# EAGLE design SparkFun_Transceiver_Breakout_RPSMA (EAGLE 7.4.0)
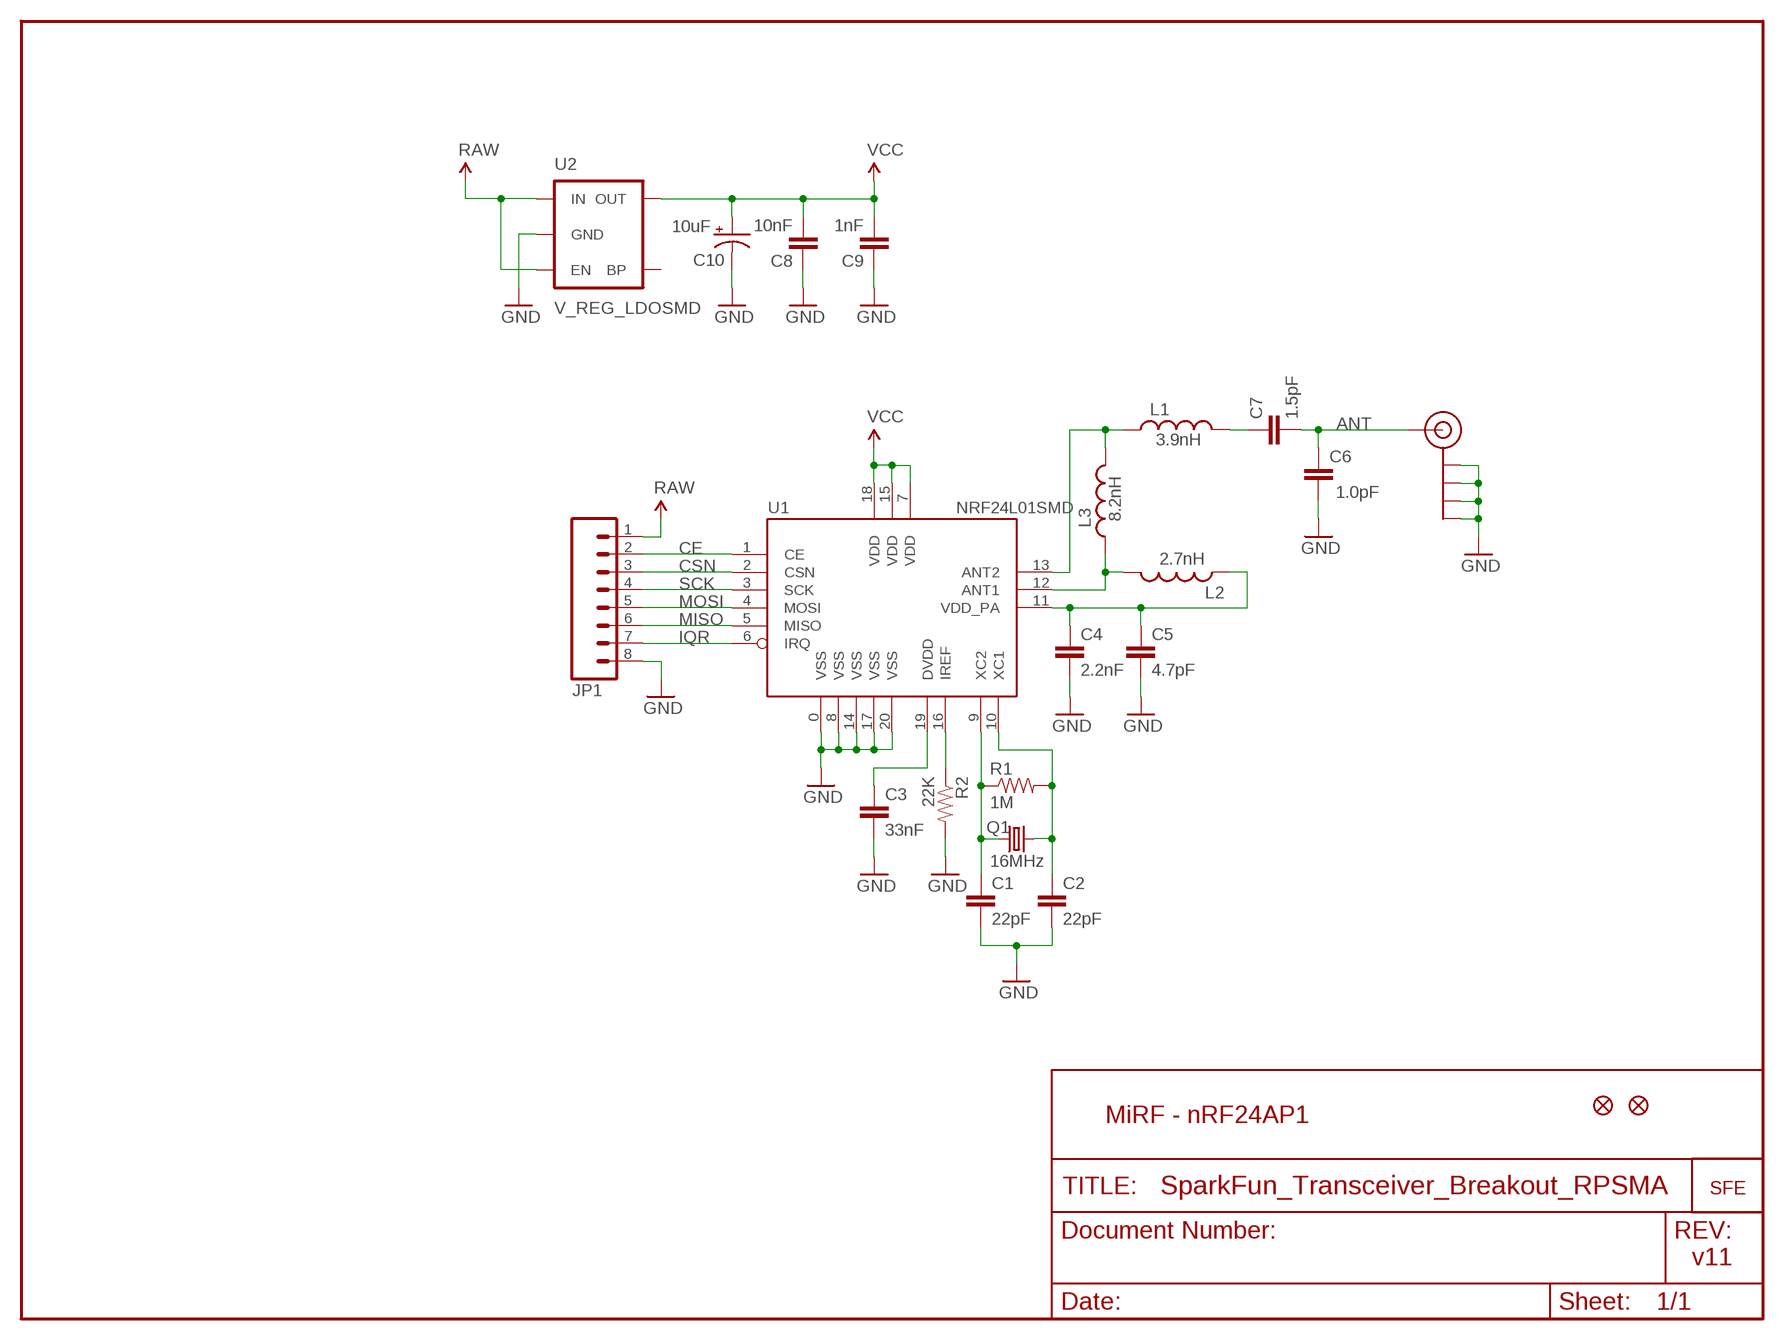
[diagram p0: schematic, sheet 1]

## Parts
C1  22pF  CAP0402  [C0402]
C2  22pF  CAP0402  [C0402]
C3  33nF  CAP0402  [C0402]
C4  2.2nF  CAP0402  [C0402]
C5  4.7pF  CAP0402  [C0402]
C6  1.0pF  CAP0402  [C0402]
C7  1.5pF  CAP0402  [C0402]
C8  10nF  CAP0402  [C0402]
C9  1nF  CAP0402  [C0402]
C10  10uF  CAP_POL1206  [EIA3216]
FID1  FIDUCIALUFIDUCIAL  [MICRO-FIDUCIAL]
FID2  FIDUCIALUFIDUCIAL  [MICRO-FIDUCIAL]
J$1  SMA_EDGE  [SMA-EDGE]
JP1  M08  [1X08]
L1  3.9nH  INDUCTOR0402  [C0402]
L2  2.7nH  INDUCTOR0402  [C0402]
L3  8.2nH  INDUCTOR0402  [C0402]
Q1  16MHz  CRYSTAL5X3  [CRYSTAL-SMD-5X3]
R1  1M  RESISTOR0402  [C0402]
R2  22K  RESISTOR0402  [C0402]
U1  NRF24L01SMD  [QFN20]
U2  V_REG_LDOSMD  [SOT23-5]
U$5  LOGO-SFENEW  [SFE-NEW-WEBLOGO]

## Nets
ANT: C6.2 C7.2 J$1.SIG(SIGNAL)
CE: JP1.2 U1.1(CE)
CSN: JP1.3 U1.2(CSN)
GND: C1.2 C2.2 C3.2 C4.2 C5.2 C6.1 C8.1 C9.1 C10.C(-) J$1.GND@0(GND) J$1.GND@1(GND) J$1.GND@2(GND) J$1.GND@3(GND) JP1.8 R2.2 U1.0(VSS) U1.8(VSS) U1.14(VSS) U1.17(VSS) U1.20(VSS) U2.2(GND)
IQR: JP1.7 U1.6(IRQ)
MISO: JP1.6 U1.5(MISO)
MOSI: JP1.5 U1.4(MOSI)
N$1: C1.1 Q1.1 R1.1 U1.9(XC2)
N$2: C2.1 Q1.3 R1.2 U1.10(XC1)
N$3: L2.2 L3.1 U1.12(ANT1)
N$4: R2.1 U1.16(IREF)
N$5: C3.1 U1.19(DVDD)
N$6: L1.1 L3.2 U1.13(ANT2)
N$7: C4.1 C5.1 L2.1 U1.11(VDD_PA)
N$9: C7.1 L1.2
RAW: JP1.1 U2.1(IN) U2.3(EN)
SCK: JP1.4 U1.3(SCK)
VCC: C8.2 C9.2 C10.A(+) U1.7(VDD) U1.15(VDD) U1.18(VDD) U2.5(OUT)
Unconnected: U2.4(BP)

## Notes on the sheet
- MiRF - nRF24AP1
- v11

## Library data of the parts
C1-C9 = SparkFun:CAP: Capacitor Standard 0603 ceramic capacitor, and 0.1" leaded capacitor.
C10 = SparkFun:CAP_POL: Capacitor Polarized These are standard SMD and PTH capacitors. Normally 10uF, 47uF, and 100uF in electrolytic and tantalum varieties. Always verify the external diameter of the through hole cap, it varies with capacity, voltage, and manufacturer. The EIA devices should be standard.
FID1 FID2 = SparkFun-Aesthetics:FIDUCIAL: Fiducial Alignment Points Various fiducial points for machine vision alignment.
J$1 = SparkFun:SMA_EDGE: SMA Antenna Connector End launch SMA connector. The paste layer has been removed so that the connector can be hand soldered onto the board after reflow.
JP1 = SparkFun:M08: Header 8 Standard 8-pin 0.1" header. Use with straight break away headers (SKU : PRT-00116), right angle break away headers (PRT-00553), swiss pins (PRT-00743), machine pins (PRT-00117), and female headers (PRT-00115).
L1-L3 = SparkFun:INDUCTOR: Inductors Basic Inductor/Choke - 0603 and 1206. Footprints are not proven and vary greatly between part numbers.
Q1 = SparkFun:CRYSTAL: Crystals Various standard crystals. Proven footprints. Spark Fun Electronics SKU : COM-00534
R1 R2 = SparkFun:RESISTOR: Resistor Basic schematic elements and footprints for 0603, 1206, and PTH 1/10th watt (small) resistors.
U1 = SparkFun:NRF24L01: 2.4GHz Low Power Transceiver This is the very popular, low cost, very low power RF transceiver from Nordic Semiconductor. Simple SPI interface. SKU: COM-00690
U2 = SparkFun:V_REG_LDO: Voltage Regulator LDO Standard 150mA LDO voltage regulator in SOT-23 layout. Micrel part MIC5205. BP (by-pass) pin is used to lower output noise with 470pF cap.
U$5 = SparkFun:LOGO-SFE: Spark Fun Electronics PCB Logo This is the standard Spark Fun Electronics PCB logo.

## Board
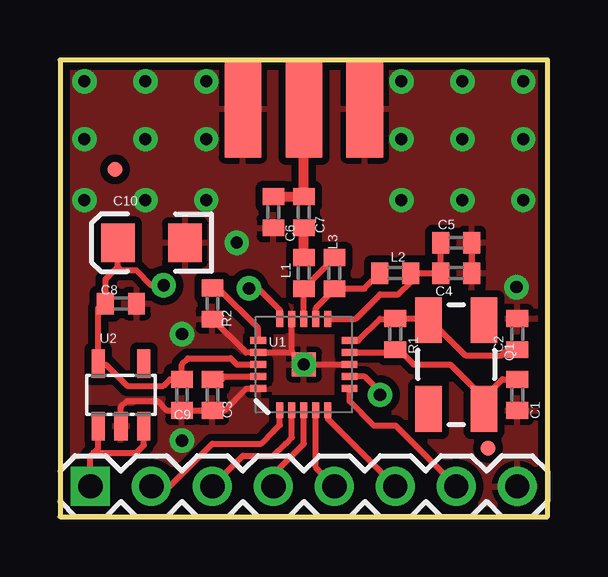
[diagram p1: board, top side]
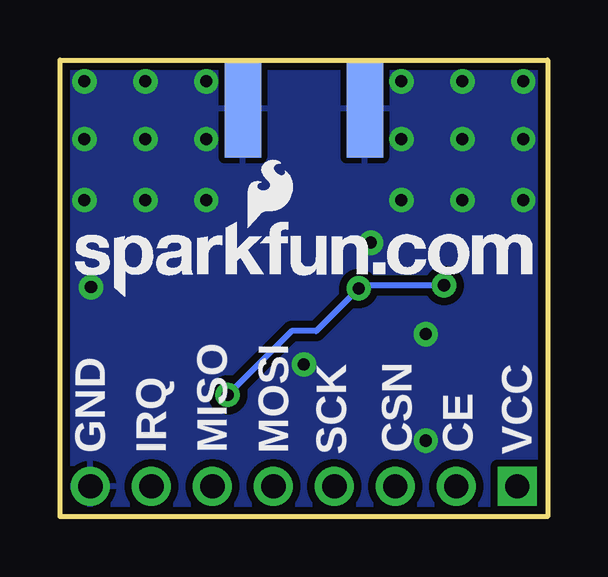
[diagram p2: board, bottom side, seen from below]

Size 20.32 x 19.05 mm. Coordinates in mm from the lower left corner, seen from the top.
Outline: 0,0 20.32,0 20.32,19.05 0,19.05 0,0
Copper layers (1*16): Top 0.035mm / dielectric 1.5mm / Bottom 0.035mm
Design rules "SparkFun *": minimum track width 8mil, minimum drill 20mil, track to track 8mil, track to pad 8mil, pad to pad 7mil, via to via 8mil, smd to smd 8mil, copper to edge 10mil, drill to drill 8mil, minimum pad ring 12mil, minimum via ring 10mil, stop-mask expansion 4mil, vias tented up to drill 25mil, thermal gap 10mil

### Footprints (pad centres in the part's own frame; a part is rotated, then mirrored left to right if it is on the bottom)
C0402 = smd 0.7 x 0.9: 1 -0.65,0; 2 0.65,0
EIA3216 = smd 1.4 x 1.6: A 1.4,0; C -1.4,0
MICRO-FIDUCIAL = smd 0.635 x 0.635: 1 0,0
SMA-EDGE = smd 1.524 x 4.064: GND@0 0,0; GND@1 5.08,0; SIG 2.54,0 | smd 1.524 x 4.064 bottom: GND@2 0,0; GND@3 5.08,0
1X08 = drill 1.016 square: 1 0,0 | drill 1.016: 2 2.54,0; 3 5.08,0; 4 7.62,0; 5 10.16,0; 6 12.7,0; 7 15.24,0; 8 17.78,0
CRYSTAL-SMD-5X3 = smd 1.9 x 1.1: 1 -1.85,-1.15; 2 1.85,-1.15; 3 1.85,1.15; 4 -1.85,1.15
QFN20 = smd 1 x 1: 0 0,0 | smd 0.65 x 0.3: 1 -1.9,1; 2 -1.9,0.5; 3 -1.9,0; 4 -1.9,-0.5; 5 -1.9,-1; 11 1.9,-1; 12 1.9,-0.5; 13 1.9,0; 14 1.9,0.5; 15 1.9,1 | smd 0.3 x 0.65: 6 -1,-1.9; 7 -0.5,-1.9; 8 0,-1.9; 9 0.5,-1.9; 10 1,-1.9; 16 1,1.9; 17 0.5,1.9; 18 0,1.9; 19 -0.5,1.9; 20 -1,1.9
SOT23-5 = smd 0.55 x 1.2: 1 -0.95,-1.3; 2 0,-1.3; 3 0.95,-1.3; 4 0.95,1.3; 5 -0.95,1.3

### Placement (x,y rotation side)
C1  19.05,5.08 270 top
C2  19.05,7.62 90 top
C3  6.35,5.08 270 top
C4  16.51,10.16 0 top
C5  16.51,11.43 0 top
C6  8.89,12.7 90 top
C7  10.16,12.7 90 top
C8  2.54,8.89 180 top
C9  5.08,5.08 90 top
C10  3.81,11.43 180 top
FID1  17.83,2.87 0 top
FID2  2.29,14.48 0 top
J$1  12.7,17.02 180 top
JP1  1.27,1.27 0 top
L1  10.16,10.16 90 top
L2  13.97,10.16 180 top
L3  11.43,10.16 90 top
Q1  16.51,6.35 90 top
R1  13.97,7.62 90 top
R2  6.35,8.89 270 top
U1  10.16,6.35 90 top
U2  2.54,5.08 0 top
U$5  19.7,9.18 0 bottom

### Tracks (layer width: path | path; a pad name or v marks a point on that pad's centre or on a via)
ANT
  Top 0.254: J$1.SIG | J$1.SIG | C7.2 10.16,13.34 10.14,13.35
  Top 0.406: C7.2 J$1.SIG | C6.2 10.14,13.35
CE
  Top 0.254: 8.89,3.56 8.38,3.05 6.35,3.05 4.57,1.27 JP1.2 | 8.89,3.56 8.9,3.57 | U1.1 9.16,3.83 8.89,3.56
CSN
  Top 0.254: 9.4,3.05 8.89,2.54 7.62,2.54 JP1.3 | 9.4,3.05 9.4,3.06 | U1.2 9.66,3.31 9.4,3.05
GND  (via drill 0.51)
  Top 0.203: 8.13,6.86 8.12,6.85 U1.17 | 8.13,5.33 8.11,5.35 U1.20
  Top 0.254: 6.35,4.45 6.33,4.43 C9.1 5.08,4.45 4.45,4.45 4.06,4.83 2.79,4.83 2.54,4.57 U2.2 | U1.20 7.76,5.35 6.86,4.45 6.35,4.45 | 6.35,4.45 C3.2 | C4.2 17.14,10.16 17.16,10.18 C5.2 | R2.2 6.35,8.26 7.75,6.85 8.12,6.85 | U1.17 9.66,6.85 | 9.66,6.85 U1.0 | 9.66,6.85 9.67,6.85 9.68,6.86 9.66,6.88 U1.14 | U1.0 U1.8 | U1.0 10.13,6.33
  other vias: 5.08,3.17 5.08,7.62 10.16,6.35 1.02,18.16 3.56,18.16 6.1,18.16 6.1,13.21 14.22,18.16 16.76,18.16 19.3,18.16 16.76,13.21 19.3,13.21 19.02,9.58 1.02,15.75 3.56,15.75 6.1,15.75 14.22,15.75 16.76,15.75 19.3,15.75 1.02,13.21 3.56,13.21 14.22,13.21 7.37,11.43
  pour Bottom (isolate 0.305): 0,0 20.32,0 20.32,19.05 0,19.05
  pour Top (isolate 0.305): 0,0 20.32,0 20.32,19.05 0,19.05
IQR
  Top 0.254: JP1.7 13.97,3.81 13.08,3.81 12.06,4.83 12.06,5.33 U1.6
MISO
  Top 0.254: U1.5 11.16,4.08 JP1.6
MOSI
  Top 0.254: U1.4 10.66,2.04 JP1.5
N$1
  Top 0.203: U1.9 12.2,6.85
  Top 0.254: 12.2,6.85 13.84,6.85 13.97,6.99 R1.1 14.11,6.97 14.73,6.35 16.26,6.35 17.65,4.95 | Q1.1 17.66,4.57 17.65,4.57 17.65,4.95 | C1.1 18.43,5.73 17.65,4.95
N$2
  Top 0.254: U1.10 12.43,7.35 13.34,8.26 13.97,8.26 R1.2 15.35,8.27 15.37,8.26 | C2.1 18.65,6.97 18.41,6.73 16.89,6.73 15.37,8.26 | 15.37,8.26 15.36,8.25 Q1.3
N$3
  Top 0.254: U1.12 10.66,8.7 11.43,9.47 L3.1 12.69,9.51 13.34,10.16 L2.2
N$4
  Top 0.254: U1.16 8.26,7.87 6.6,9.53 6.35,9.53 R2.1
N$5
  Top 0.203: C3.1 6.49,5.48 | 8.13,5.84 8.12,5.85 U1.19
  Top 0.254: 6.49,5.48 6.86,5.84 8.13,5.84
N$6
  Top 0.254: U1.13 L1.1 10.16,9.53 11.43,10.79 L3.2
N$7
  Top 0.254: U1.11 12.31,8.25 13.34,9.27 14.1,9.27 14.61,9.78 14.61,10.16 L2.1 C4.1 | C4.1 15.88,10.16 | C4.1 15.86,10.27 15.88,10.29 15.86,10.3 C5.1
N$9
  Top 0.406: L1.2 C7.1
RAW
  Top 0.254: JP1.1 1.27,2.54 1.4,2.67 | U2.3 3.49,2.98 3.17,2.67 1.4,2.67 | U2.1 1.59,2.86 1.4,2.67
SCK
  Top 0.254: JP1.4 8.89,1.78 10.16,3.05 U1.3
VCC  (via drill 0.51)
  Top 0.203: U1.7 12.18,5.85
  Top 0.254: C9.2 5.09,5.73 | U1.15 9.16,8.62 8.26,9.53 v7.87,9.53 | v13.34,5.08 13.34,5.21 12.69,5.85 U1.7 | 1.89,9 1.91,9.02 | 1.89,9 C8.2 1.91,8.89 1.91,9.91 2.41,10.41 | 1.89,9 1.59,8.7 U2.5 1.62,6.38 1.65,6.35 1.91,6.35 2.79,5.46 4.32,5.46 4.59,5.73 C9.2 | 2.41,10.41 C10.A | v4.32,9.65 3.81,9.65 3.17,10.29 2.54,10.29 2.41,10.41 | U1.18 7.37,6.35 7.11,6.6 5.33,6.6 5.08,6.35 C9.2 | C9.2 5.08,5.71
  Bottom 0.254: v4.32,9.65 7.75,9.65 v7.87,9.53 9.65,7.75 10.67,7.75 v13.34,5.08

### Text on the board
bPlace: VCC | CE | CSN | SCK | MOSI | MISO | IRQ | GND
tValues: RP-SMA | DNP